# Altium schematic sheet Sensors.SchDoc
size A
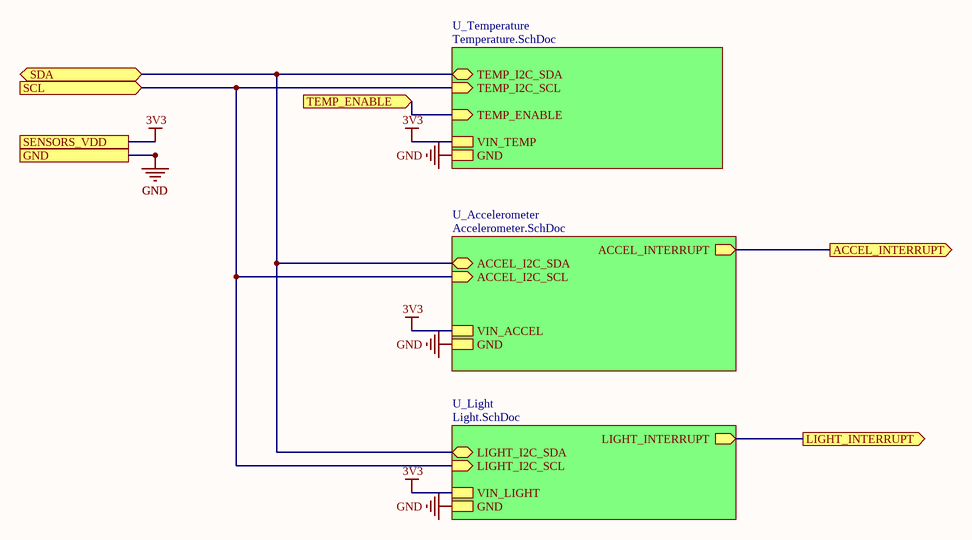
[diagram p0: Sensors.SchDoc]

## Sub-sheets
U_Accelerometer = Accelerometer.SchDoc: VIN_ACCEL, ACCEL_I2C_SDA (bidir), ACCEL_I2C_SCL (in), ACCEL_INTERRUPT (out), GND
U_Light = Light.SchDoc: VIN_LIGHT, LIGHT_I2C_SDA (bidir), LIGHT_I2C_SCL (in), GND, LIGHT_INTERRUPT (out)
U_Temperature = Temperature.SchDoc: VIN_TEMP, TEMP_I2C_SDA (bidir), TEMP_I2C_SCL (in), TEMP_ENABLE (in), GND

## Ports
ACCEL_INTERRUPT (out), GND, LIGHT_INTERRUPT (out), SCL (in), SDA (bidir), SENSORS_VDD, TEMP_ENABLE (in)

## Nets
 3V3: port SENSORS_VDD, sheet U_Temperature/VIN_TEMP, sheet U_Accelerometer/VIN_ACCEL, sheet U_Light/VIN_LIGHT
GND: port GND, sheet U_Temperature/GND, sheet U_Accelerometer/GND, sheet U_Light/GND
ACCEL_INTERRUPT: port ACCEL_INTERRUPT, sheet U_Accelerometer/ACCEL_INTERRUPT
LIGHT_INTERRUPT: port LIGHT_INTERRUPT, sheet U_Light/LIGHT_INTERRUPT
SCL: port SCL, sheet U_Temperature/TEMP_I2C_SCL, sheet U_Accelerometer/ACCEL_I2C_SCL, sheet U_Light/LIGHT_I2C_SCL
SDA: port SDA, sheet U_Temperature/TEMP_I2C_SDA, sheet U_Accelerometer/ACCEL_I2C_SDA, sheet U_Light/LIGHT_I2C_SDA
TEMP_ENABLE: port TEMP_ENABLE, sheet U_Temperature/TEMP_ENABLE